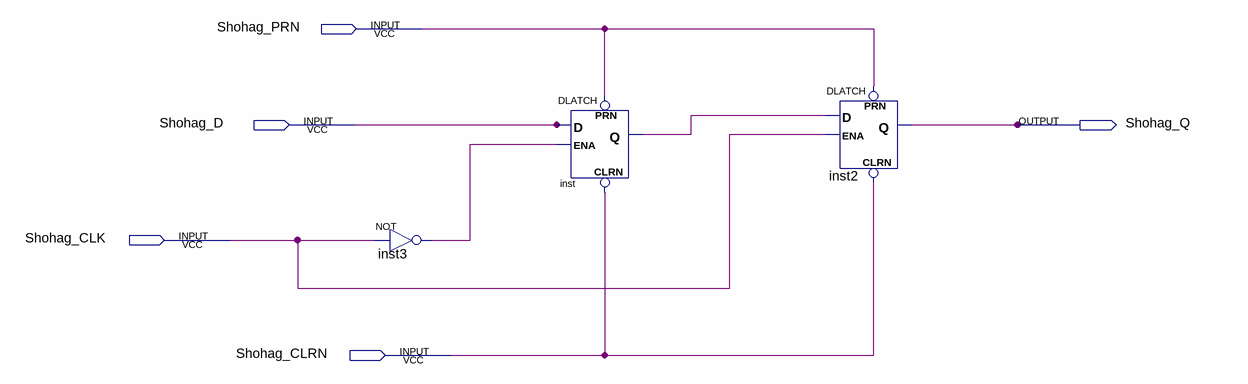
[diagram p0: schematic sheet]
// Quartus schematic Shohag_DLatch_DFlip_Flop_Master_Slave.bdf as structural Verilog: 3 symbols, 5 pins
module Shohag_DLatch_DFlip_Flop_Master_Slave (
  input  Shohag_PRN,
  input  Shohag_D,
  input  Shohag_CLK,
  input  Shohag_CLRN,
  output Shohag_Q
);

  wire inst3_out, inst_q;

  not inst3 (inst3_out, Shohag_CLK);
  DLATCH inst (.CLRN(Shohag_CLRN), .D(Shohag_D), .ENA(inst3_out), .PRN(Shohag_PRN), .Q(inst_q));
  DLATCH inst2 (.CLRN(Shohag_CLRN), .D(inst_q), .ENA(Shohag_CLK), .PRN(Shohag_PRN), .Q(Shohag_Q));
endmodule
